# Altium schematic sheet DISPLAY.SchDoc
size A
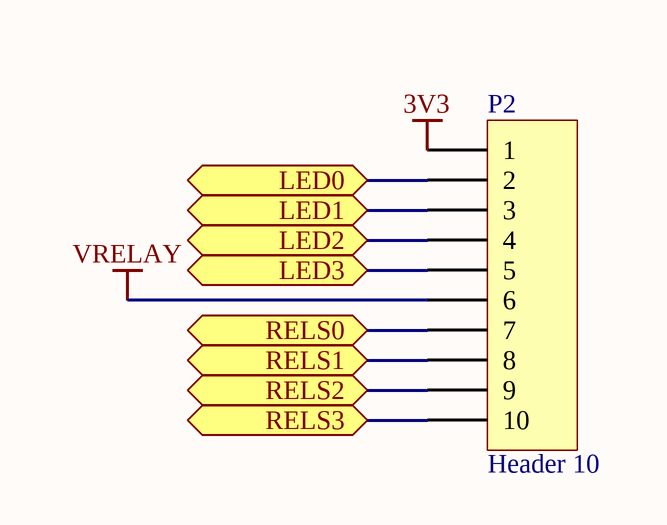
[diagram p0: DISPLAY.SchDoc]

## Parts
P2  Header 10  [BUS_10]

## Ports
LED0, LED1, LED2, LED3, RELS0, RELS1, RELS2, RELS3

## Nets
3V3: P2.1
VRELAY: P2.6
LED0: P2.2 ; port LED0
LED1: P2.3 ; port LED1
LED2: P2.4 ; port LED2
LED3: P2.5 ; port LED3
RELS0: P2.7 ; port RELS0
RELS1: P2.8 ; port RELS1
RELS2: P2.9 ; port RELS2
RELS3: P2.10 ; port RELS3

## Library data of the parts
P2 = Header 10: Header, 10-Pin; LatestRevisionDate: 17-Jul-2002; LatestRevisionNote: Re-released for DXP Platform.; Publisher: Altium Limited